# Altium schematic sheet changelog.SchDoc: Changelog and document index
size A4; SheetNumber: 3; SheetTotal: 20; TitleBig: Document index and revision history; Desc_line1: Detailed changelog and complete document sheets index.; Desc_line2: All along the schematic pages, a sheet title and description will be written on this corner.
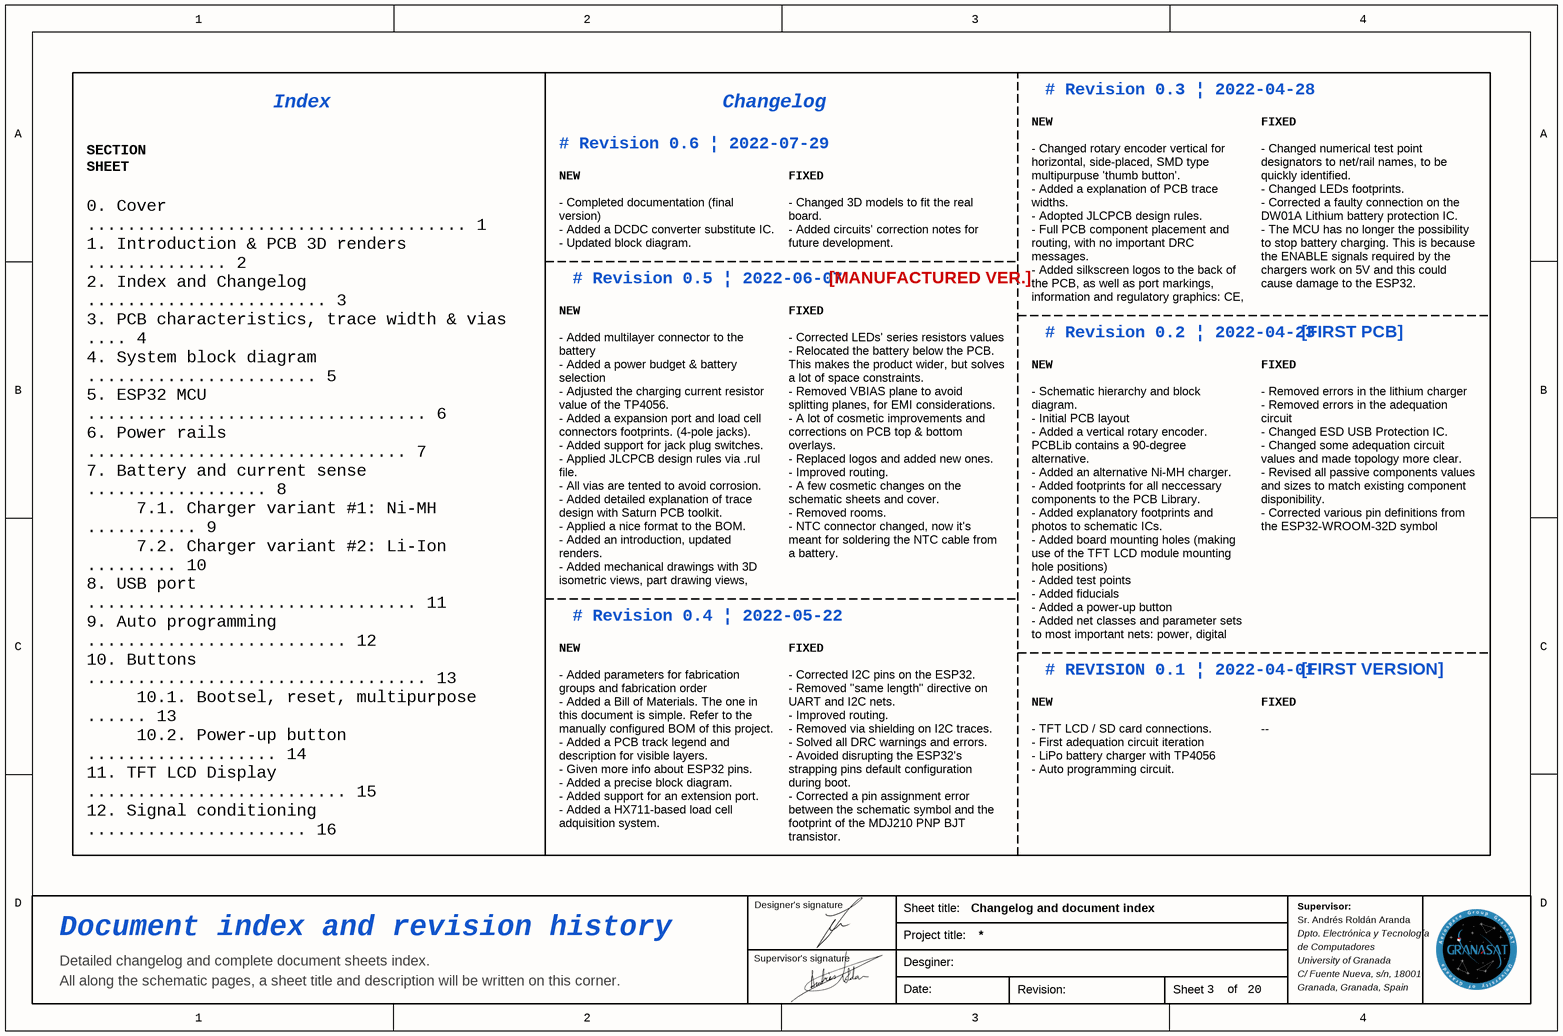
[diagram p0: changelog.SchDoc]

## Notes on the sheet
- Index
- Changelog
- # Revision 0.3 | 2022-04-28
- SECTION                                             SHEET
- # Revision 0.6 | 2022-07-29
- NEW
- FIXED
- - Completed documentation (final version)
  - Added a DCDC converter substitute IC.
  - Updated block diagram.
- - Changed 3D models to fit the real board.
  - Added circuits' correction notes for future development.
- # Revision 0.5 | 2022-06-07
- [MANUFACTURED VER.]
- - Changed rotary encoder vertical for horizontal, side-placed, SMD type multipurpuse 'thumb button'.
  - Added a explanation of PCB trace widths.
  - Adopted JLCPCB design rules.
  - Full PCB component placement and routing, with no important DRC messages.
  - Added silkscreen logos to the back of the PCB, as well as port markings, information and regulatory graphics: CE, WEEE, ESD sensitive warning and RoHS.
- - Changed numerical test point designators to net/rail names, to be quickly identified.
  - Changed LEDs footprints.
  - Corrected a faulty connection on the DW01A Lithium battery protection IC.
  - The MCU has no longer the possibility to stop battery charging. This is because the ENABLE signals required by the chargers work on 5V and this could cause damage to the ESP32.
- # Revision 0.2 | 2022-04-23
- [FIRST PCB]
- - Added multilayer connector to the battery
  - Added a power budget & battery selection
  - Adjusted the charging current resistor value of the TP4056.
  - Added a expansion port and load cell connectors footprints. (4-pole jacks).
  - Added support for jack plug switches.
  - Applied JLCPCB design rules via .rul file.
  - All vias are tented to avoid corrosion.
  - Added detailed explanation of trace design with Saturn PCB toolkit.
  - Applied a nice format to the BOM.
  - Added an introduction, updated renders.
  - Added mechanical drawings with 3D isometric views, part drawing views, measurements, layer stackup, drills, etc.
  - Added Gerber and NC Drills fabrication jobs for ordering PCB and its stencil.
- - Corrected LEDs' series resistors values
  - Relocated the battery below the PCB. This makes the product wider, but solves a lot of space constraints.
  - Removed VBIAS plane to avoid splitting planes, for EMI considerations.
  - A lot of cosmetic improvements and corrections on PCB top & bottom overlays.
  - Replaced logos and added new ones.
  - Improved routing.
  - A few cosmetic changes on the schematic sheets and cover.
  - Removed rooms.
  - NTC connector changed, now it's meant for soldering the NTC cable from a battery.
- # Revision 0.4 | 2022-05-22
- - Schematic hierarchy and block diagram.
  - Initial PCB layout
  - Added a vertical rotary encoder. PCBLib contains a 90-degree alternative.
  - Added an alternative Ni-MH charger.
  - Added footprints for all neccessary components to the PCB Library.
  - Added explanatory footprints and photos to schematic ICs.
  - Added board mounting holes (making use of the TFT LCD module mounting hole positions)
  - Added test points
  - Added fiducials
  - Added a power-up button
  - Added net classes and parameter sets to most important nets: power, digital communications, analog signals, etc.
- - Removed errors in the lithium charger
  - Removed errors in the adequation circuit
  - Changed ESD USB Protection IC.
  - Changed some adequation circuit values and made topology more clear.
  - Revised all passive components values and sizes to match existing component disponibility.
  - Corrected various pin definitions from the ESP32-WROOM-32D symbol
- # REVISION 0.1 | 2022-04-01
- [FIRST VERSION]
- - TFT LCD / SD card connections.
  - First adequation circuit iteration
  - LiPo battery charger with TP4056
  - Auto programming circuit.
- --
- 0. Cover ...................................... 1
  1. Introduction & PCB 3D renders .............. 2
  2. Index and Changelog ........................ 3
  3. PCB characteristics, trace width & vias .... 4
  4. System block diagram ....................... 5
  5. ESP32 MCU .................................. 6
  6. Power rails ................................ 7
  7. Battery and current sense .................. 8
  7.1. Charger variant #1: Ni-MH ........... 9
  7.2. Charger variant #2: Li-Ion ......... 10
  8. USB port  ................................. 11
  9. Auto programming .......................... 12
  10. Buttons .................................. 13
  10.1. Bootsel, reset, multipurpose ...... 13
  10.2. Power-up button ................... 14
  11. TFT LCD Display .......................... 15
  12. Signal conditioning ...................... 16
  12.1. Conditioning circuit .............. 16
  12.2. Circuit simulations 1 ............. 17
  12.3. Circuit simulations 2 ............. 18
  14. Expansion port ........................... 19
  13. Load cell amplifier ...................... 20
  15. Power budget & battery selection ......... 21
  16. 3D PCB (PDF3D) ........................... 22
  17. PCB layers prints ........................ 23
  17.1. Top ............................... 23
  17.2. Bottom ............................ 24
  18. Mechanical schematics (Draftsman) ........ 25
  18.1. Isometric views ................... 25
  18.2. Part views & measurements ......... 26
  18.3. Layer stackup, top/bottom, drills . 27
  18.4. Bill of materials ................. 28
- - Added parameters for fabrication groups and fabrication order
  - Added a Bill of Materials. The one in this document is simple. Refer to the manually configured BOM of this project.
  - Added a PCB track legend and description for visible layers.
  - Given more info about ESP32 pins.
  - Added a precise block diagram.
  - Added support for an extension port.
  - Added a HX711-based load cell adquisition system.
- - Corrected I2C pins on the ESP32.
  - Removed "same length" directive on UART and I2C nets.
  - Improved routing.
  - Removed via shielding on I2C traces.
  - Solved all DRC warnings and errors.
  - Avoided disrupting the ESP32's strapping pins default configuration during boot.
  - Corrected a pin assignment error between the schematic symbol and the footprint of the MDJ210 PNP BJT transistor.
  - Removed PCB cutouts.
- Designer's signature
- Sheet title:
- Sr. Andrés Roldán Aranda
- Supervisor:
- Supervisor's signature
- Project title:
- Desginer:
- Dpto. Electrónica y Tecnología
- de Computadores
- University of Granada
- C/ Fuente Nueva, s/n, 18001
- Granada, Granada, Spain
- Date:
- Revision:
- Sheet
- of